# Altium schematic sheet FPGA_Misc.SchDoc: SVPXFMC Carrier 3U
size 420 x 297 mm; CheckedBy: \; Author: G.Kasprowicz; CompanyName: ISE; DrawnBy: T.Przywozki; Organization: WUT ISE; Address1: Warsaw University of Technology; Address2: Nowowiejska 15/19 00-665 Warsaw; Revision: 1.0.; SheetNumber: 18; SheetTotal: 20; Project: SVPXFMC Carrier 3U; ModifiedBy: -; CheckedDate: -; Title2: FPGA Misc; DivGrp: ISE; Designer: G. Kasprowicz
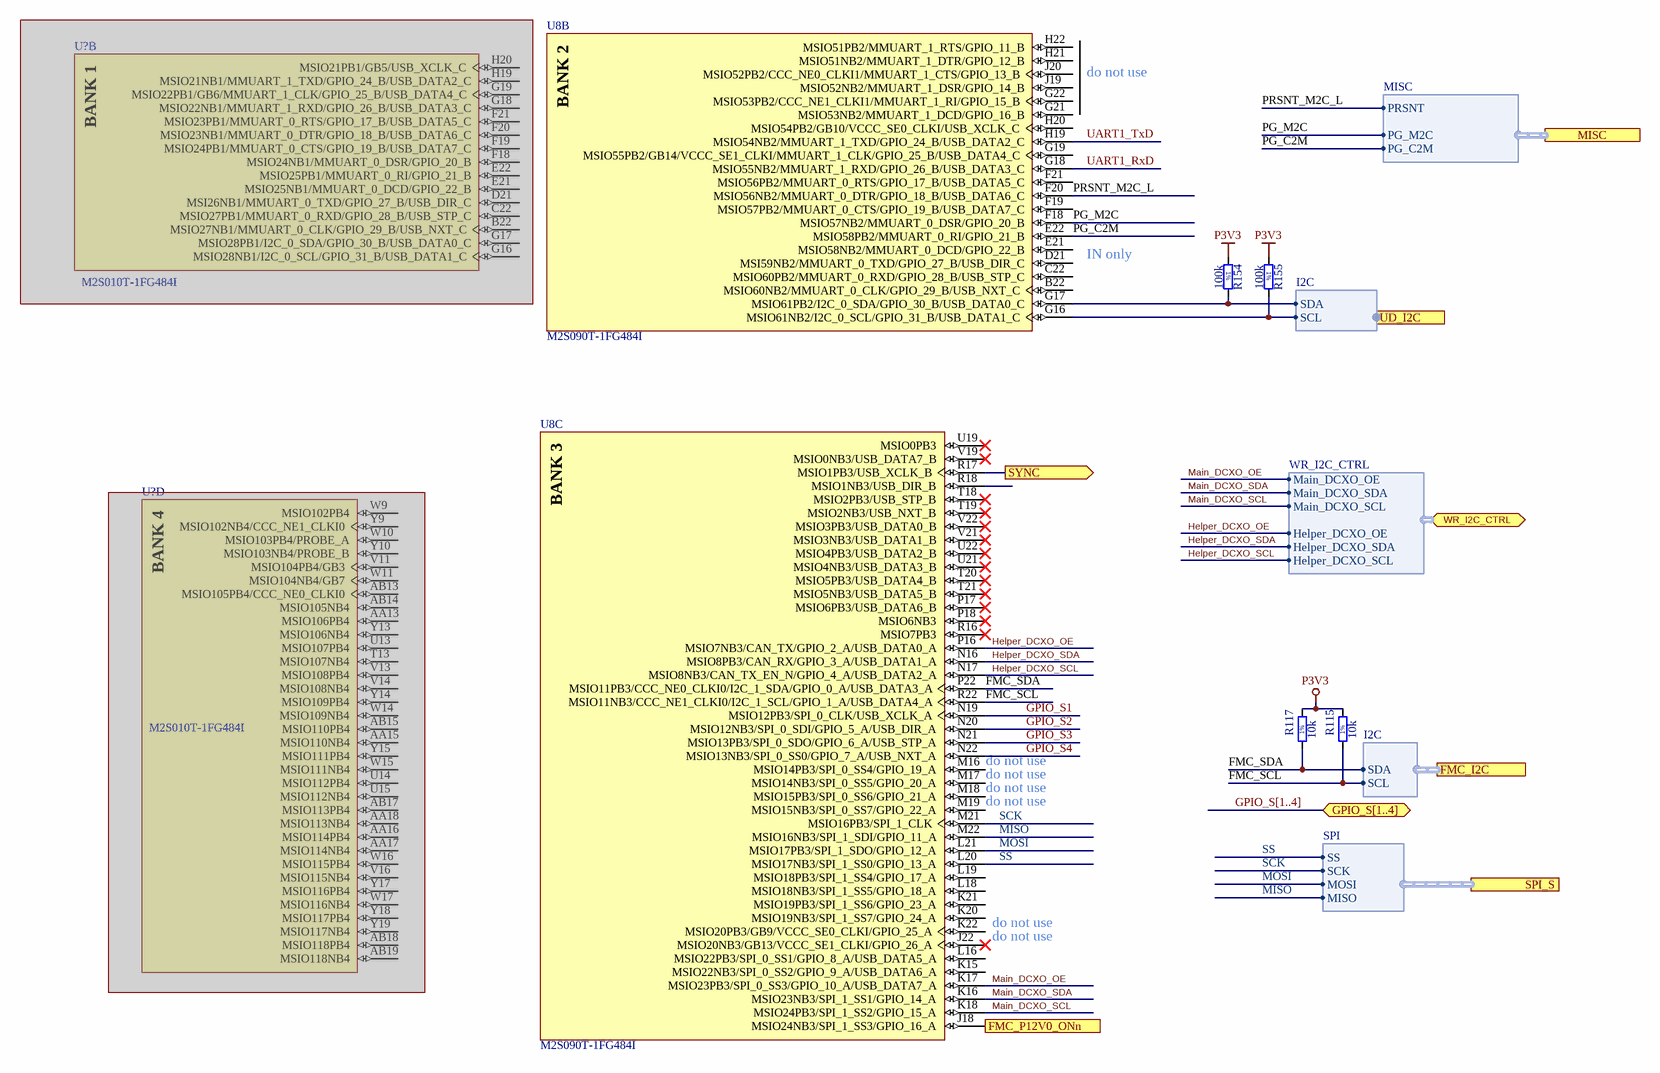
[diagram p0: FPGA_Misc.SchDoc]

## Parts
(Parts that share a designator on the sheet are numbered #1, #2 ... from top to bottom, then left to right.)
R115  10k  [RESC1005X40N]
R117  10k  [RESC1005X40N]
R154  100k  [RESC1005X40N]
R155  100k  [RESC1005X40N]
U8  M2S090T-1FG484I  [MCSM-FG-484_V]  (parts B,C of 15)
U?#1  M2S010T-1FG484I  [MCSM-FG-484_V]  (part B of 16)  (masked out: inside a compile mask, not in the netlist)
U?#2  M2S010T-1FG484I  [MCSM-FG-484_V]  (part D of 16)  (masked out: inside a compile mask, not in the netlist)

## Ports
FMC_I2C (harness I2C), FMC_P12V0_ONn (out), GPIO_S[1..4] (bidir), MISC (harness MISC), SPI_S (harness SPI), SYNC (out), UD_I2C (harness I2C), WR_I2C_CTRL (bidir, harness WR_I2C_CTRL)

## Harnesses
I2C: SCL, SDA
MISC: PRSNT, PG_M2C, PG_C2M
SPI: MISO, MOSI, SCK, SS
WR_I2C_CTRL: Main_DCXO_OE, Main_DCXO_SDA, Main_DCXO_SCL, Helper_DCXO_OE, Helper_DCXO_SDA, Helper_DCXO_SCL
I2C: SDA, SCL

## Nets
P3V3: R115.2 R117.2 R154.1 R155.1
FMC_P12V0_ONn: U8.J18(MSIO24NB3/SPI_1_SS3/GPIO_16_A) ; port FMC_P12V0_ONn
FMC_SCL: R115.1 U8.R22(MSIO11NB3/CCC_NE1_CLKI0/I2C_1_SCL/GPIO_1_A/USB_DATA4_A) ; port FMC_I2C.SCL
FMC_SDA: R117.1 U8.P22(MSIO11PB3/CCC_NE0_CLKI0/I2C_1_SDA/GPIO_0_A/USB_DATA3_A) ; port FMC_I2C.SDA
GPIO_S1: U8.N19(MSIO12PB3/SPI_0_CLK/USB_XCLK_A)
GPIO_S2: U8.N20(MSIO12NB3/SPI_0_SDI/GPIO_5_A/USB_DIR_A)
GPIO_S3: U8.N21(MSIO13PB3/SPI_0_SDO/GPIO_6_A/USB_STP_A)
GPIO_S4: U8.N22(MSIO13NB3/SPI_0_SS0/GPIO_7_A/USB_NXT_A)
Helper_DCXO_OE: U8.P16(MSIO7NB3/CAN_TX/GPIO_2_A/USB_DATA0_A) ; port WR_I2C_CTRL.Helper_DCXO_OE
Helper_DCXO_SCL: U8.N17(MSIO8NB3/CAN_TX_EN_N/GPIO_4_A/USB_DATA2_A) ; port WR_I2C_CTRL.Helper_DCXO_SCL
Helper_DCXO_SDA: U8.N16(MSIO8PB3/CAN_RX/GPIO_3_A/USB_DATA1_A) ; port WR_I2C_CTRL.Helper_DCXO_SDA
Main_DCXO_OE: U8.K17(MSIO23PB3/SPI_0_SS3/GPIO_10_A/USB_DATA7_A) ; port WR_I2C_CTRL.Main_DCXO_OE
Main_DCXO_SCL: U8.K18(MSIO24PB3/SPI_1_SS2/GPIO_15_A) ; port WR_I2C_CTRL.Main_DCXO_SCL
Main_DCXO_SDA: U8.K16(MSIO23NB3/SPI_1_SS1/GPIO_14_A) ; port WR_I2C_CTRL.Main_DCXO_SDA
MISO: U8.M22(MSIO16NB3/SPI_1_SDI/GPIO_11_A) ; port SPI_S.MISO
MOSI: U8.L21(MSIO17PB3/SPI_1_SDO/GPIO_12_A) ; port SPI_S.MOSI
PG_C2M: U8.E22(MSIO58PB2/MMUART_0_RI/GPIO_21_B) ; port MISC.PG_C2M
PG_M2C: U8.F18(MSIO57NB2/MMUART_0_DSR/GPIO_20_B) ; port MISC.PG_M2C
PRSNT_M2C_L: U8.F20(MSIO56NB2/MMUART_0_DTR/GPIO_18_B/USB_DATA6_C) ; port MISC.PRSNT
SCK: U8.M21(MSIO16PB3/SPI_1_CLK) ; port SPI_S.SCK
SS: U8.L20(MSIO17NB3/SPI_1_SS0/GPIO_13_A) ; port SPI_S.SS
SYNC: U8.R17(MSIO1PB3/USB_XCLK_B) ; port SYNC
UART1_RxD: U8.G18(MSIO55NB2/MMUART_1_RXD/GPIO_26_B/USB_DATA3_C)
UART1_TxD: U8.H19(MSIO54NB2/MMUART_1_TXD/GPIO_24_B/USB_DATA2_C)
NetR154_2: R154.2 U8.G17(MSIO61PB2/I2C_0_SDA/GPIO_30_B/USB_DATA0_C) ; port UD_I2C.SDA
NetR155_2: R155.2 U8.G16(MSIO61NB2/I2C_0_SCL/GPIO_31_B/USB_DATA1_C) ; port UD_I2C.SCL

Not connected (* = marked no-connect by the designer): U8 B22(MSIO60NB2/MMUART_0_CLK/GPIO_29_B/USB_NXT_C) C22(MSIO60PB2/MMUART_0_RXD/GPIO_28_B/USB_STP_C) D21(MSI59NB2/MMUART_0_TXD/GPIO_27_B/USB_DIR_C) E21(MSIO58NB2/MMUART_0_DCD/GPIO_22_B) F19(MSIO57PB2/MMUART_0_CTS/GPIO_19_B/USB_DATA7_C) F21(MSIO56PB2/MMUART_0_RTS/GPIO_17_B/USB_DATA5_C) G19(MSIO55PB2/GB14/VCCC_SE1_CLKI/MMUART_1_CLK/GPIO_25_B/USB_DATA4_C) G21(MSIO53NB2/MMUART_1_DCD/GPIO_16_B) G22(MSIO53PB2/CCC_NE1_CLKI1/MMUART_1_RI/GPIO_15_B) H20(MSIO54PB2/GB10/VCCC_SE0_CLKI/USB_XCLK_C) H21(MSIO51NB2/MMUART_1_DTR/GPIO_12_B) H22(MSIO51PB2/MMUART_1_RTS/GPIO_11_B) J19(MSIO52NB2/MMUART_1_DSR/GPIO_14_B) J20(MSIO52PB2/CCC_NE0_CLKI1/MMUART_1_CTS/GPIO_13_B) J22(MSIO20NB3/GB13/VCCC_SE1_CLKI/GPIO_26_A)* K15(MSIO22NB3/SPI_0_SS2/GPIO_9_A/USB_DATA6_A) K20(MSIO19NB3/SPI_1_SS7/GPIO_24_A) K21(MSIO19PB3/SPI_1_SS6/GPIO_23_A) K22(MSIO20PB3/GB9/VCCC_SE0_CLKI/GPIO_25_A) L16(MSIO22PB3/SPI_0_SS1/GPIO_8_A/USB_DATA5_A) L18(MSIO18NB3/SPI_1_SS5/GPIO_18_A) L19(MSIO18PB3/SPI_1_SS4/GPIO_17_A) M16(MSIO14PB3/SPI_0_SS4/GPIO_19_A) M17(MSIO14NB3/SPI_0_SS5/GPIO_20_A) M18(MSIO15PB3/SPI_0_SS6/GPIO_21_A) M19(MSIO15NB3/SPI_0_SS7/GPIO_22_A) P17(MSIO6PB3/USB_DATA6_B)* P18(MSIO6NB3)* R16(MSIO7PB3)* R18(MSIO1NB3/USB_DIR_B) T18(MSIO2PB3/USB_STP_B)* T19(MSIO2NB3/USB_NXT_B)* T20(MSIO5PB3/USB_DATA4_B)* T21(MSIO5NB3/USB_DATA5_B)* U19(MSIO0PB3)* U21(MSIO4NB3/USB_DATA3_B)* U22(MSIO4PB3/USB_DATA2_B)* V19(MSIO0NB3/USB_DATA7_B)* V21(MSIO3NB3/USB_DATA1_B)* V22(MSIO3PB3/USB_DATA0_B)*

## Buses and harness runs
bus GPIO_S[1..4] = port GPIO_S[1..4]

## Notes on the sheet
- do not use
- IN only
- (near U8) do not use
- Project/Equipment
- Document
- Designer
- Drawn by
- Check.by
- File
- Last Mod.
- Print Date
- Sheet
- Size
- A3
- of
- Rev
- Copyright WUT ISE 2019
  This documentation describes Open Hardware and is licensed under the CERN OHL v.1.1. You may redistribute and modify this documentation under the terms of the CERN OHL v1.1.
  (http://ohwr.org/CERNOHL). This documentation is dristributed WITHOUT ANY EXPRESS OR IMPLIED WARRANTY, INCLUDING OF MERCHANTABILITY, SATISFACTORY QUALITY AND FITNESS FOR A PARTICULAR PURPOSE. Please see the CERN OHL v.1.1 for applicable conditions
- (in symbol CMP-0959-00045-1, part B) BANK 2
- (in symbol CMP-0959-00045-1, part C) BANK 3
- (in symbol CMP-0959-00069-1, part B) BANK 1
- (in symbol CMP-0959-00069-1, part D) BANK 4
- (in symbol R0402_10K_1%_0.0625W_100PPM) 1%
- (in symbol R0402_100K_1%_0.0625W_100PPM) 1%

## Library data of the parts
R115 R117 = R0402_10K_1%_0.0625W_100PPM: Resistor - 1%; Manufacturer: GENERIC; Part Description: General Purpose Thick Film Chip Resistor; Manufacturer1 Part Number: 232270671003L; TC: ±100ppm/°C; PressFit: No; Manufacturer Part Number: R0402_10K_1%_0.0625W_100PPM; Part Number: R0402_10K_1%_0.0625W_100PPM; Tolerance: ±1%; Value: 10k; Component Kind: Standard; Component Type: Standard; Pin Count: 2; Status: Not Recommended; Power: 0.0625W; Case: 0402; Mounted: Yes; Sense: No; Socket: No; SMD: Yes; Manufacturer1 Example: YAGEO PHYCOMP; Manufacturer1 ComponentHeight: 0.4mm; HelpURL: \\cern.ch\dfs\Applications\Altium\Datasheets\R0402_Phycomp_RC0402.pdf; Author: CERN DEM JLC; CreateDate: 03/12/2007; LatestRevisionDate: 17/10/2012
R154 R155 = R0402_100K_1%_0.0625W_100PPM: Resistor - 1%; Part Description: General Purpose Thick Film Chip Resistor; Manufacturer: GENERIC; Manufacturer1 Part Number: 232270671004L; TC: ±100ppm/°C; PressFit: No; Part Number: R0402_100K_1%_0.0625W_100PPM; Component Kind: Standard; Component Type: Standard; Pin Count: 2; Value: 100k; Status: Not Recommended; Power: 0.0625W; Tolerance: ±1%; Manufacturer Part Number: R0402_100K_1%_0.0625W_100PPM; Case: 0402; Mounted: Yes; Sense: No; Socket: No; SMD: Yes; Manufacturer1 Example: YAGEO PHYCOMP; Manufacturer1 ComponentHeight: 0.4mm; HelpURL: \\cern.ch\dfs\Applications\Altium\Datasheets\R0402_Phycomp_RC0402.pdf; Author: CERN DEM JLC; CreateDate: 03.12.2007; LatestRevisionDate: 17.10.2012
U8 = CMP-0959-00045-1: SmartFusion2 SoC FPGA, ARM Cortex-M3, 90 K LUTs, 267 User I/O, Transceiver Available, Design Security, Speed Grade 1, -40 to 100 degC, 484-Ball BGA; Manufacturer: Microsemi; Total User I/O: 267; PLLs and CCCs: 6; LSRAM 18K Blocks: 109; eNVM (K Bytes): 512; DDR Controllers (Count x Width): 1x18; Math Blocks (18x18): 84; Maximum Logic Elements: 86,316; eSRAM (K Bytes): 64; MSIOD (2.5V): 40; SERDES Lanes: 4; MSIO (3.3V): 157; Total RAM (K bits): 2074; DDRIO (2.5V): 70; uSRAM1K Blocks: 112; eSRAM (K Bytes) Non SECDED: 80; ComponentLink3URL: http://www.microsemi.com/document-portal/doc_download/131095-package-mechanical-drawings; DatasheetVersion: Rev. 5; ComponentLink3Description: Package Specification; ComponentLink1Description: Manufacturer URL; PackageReference: FG-484; RoHS: FALSE; ComponentLink1URL: http://www.microsemi.com/; Code_JEDEC: MS-034; Mounting Technology: Surface Mount; PackageDescription: 484-Ball Fine Pitch Plastic Ball Grid Array (FBGA), Body 23 x 23 mm, Pitch 1 mm; PackageVersion: Rev. 48, 11/2013; ComponentLink2URL: http://www.microsemi.com/document-portal/doc_download/130717-smartfusion2-datasheet; PartNumber: M2S090T-1FG484I; ComponentLink2Description: Datasheet; PartId: 1
U?#1 U?#2 = CMP-0959-00069-1: SmartFusion2 SoC FPGA, ARM Cortex-M3, 10 K LUTs, 233 User I/O, Transceiver Available, Design Security, Speed Grade 1, -40 to 100 degC, 484-Ball BGA; Manufacturer: Microsemi; MSIO (3.3V): 123; DDRIO (2.5V): 70; eSRAM (K Bytes): 64; uSRAM1K Blocks: 22; SERDES Lanes: 4; DDR Controllers (Count x Width): 1x18; MSIOD (2.5V): 40; Maximum Logic Elements: 12,084; eNVM (K Bytes): 256; PLLs and CCCs: 2; LSRAM 18K Blocks: 21; eSRAM (K Bytes) Non SECDED: 80; Total RAM (K bits): 400; Total User I/O: 233; PackageVersion: Rev. 48, 11/2013; ComponentLink3URL: http://www.microsemi.com/document-portal/doc_download/131095-package-mechanical-drawings; ComponentLink1Description: Manufacturer URL; DatasheetVersion: Rev. 5; RoHS: FALSE; ComponentLink2Description: Datasheet; Code_JEDEC: MS-034; ComponentLink3Description: Package Specification; ComponentLink2URL: http://www.microsemi.com/document-portal/doc_download/130717-smartfusion2-datasheet; PartNumber: M2S010T-1FG484I; ComponentLink1URL: http://www.microsemi.com/; Math Blocks (18x18): 22; Mounting Technology: Surface Mount; PackageDescription: 484-Ball Fine Pitch Plastic Ball Grid Array (FBGA), Body 23 x 23 mm, Pitch 1 mm; PackageReference: FG-484